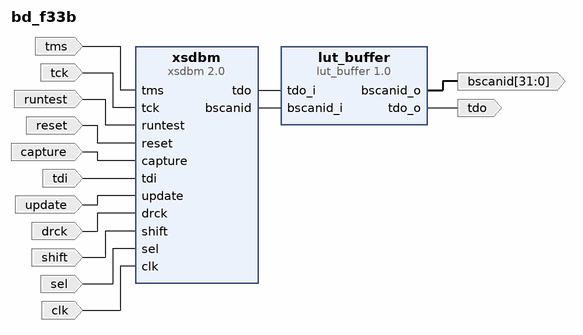
[diagram p0: block diagram of the top level]
# Vivado block design bd_f33b, xcku115-flvf1924-2-e, Vivado 2016.4
create_bd_design bd_f33b

create_bd_port -dir I -type clk clk
create_bd_port -dir I drck
create_bd_port -dir I shift
create_bd_port -dir I tdi
create_bd_port -dir I update
create_bd_port -dir I sel
create_bd_port -dir O tdo
create_bd_port -dir I tms
create_bd_port -dir I tck
create_bd_port -dir I runtest
create_bd_port -dir I reset
create_bd_port -dir I capture
create_bd_port -dir O -from 31 -to 0 bscanid

create_bd_cell -type ip -vlnv xilinx.com:ip:xsdbm:2.0 xsdbm
set_property -dict [list \
  CONFIG.C_TWO_PRIM_MODE false \
  CONFIG.C_USE_EXT_BSCAN true \
  CONFIG.C_USE_STARTUP_CLK false \
  CONFIG.C_ENABLE_CLK_DIVIDER false \
  CONFIG.C_USER_SCAN_CHAIN 1 \
  CONFIG.C_CORE_TYPE 1 \
  CONFIG.C_EN_INT_SIM 1 \
  CONFIG.C_DCLK_HAS_RESET 0 \
  CONFIG.C_USE_BUFR 0 \
  CONFIG.C_XSDB_NUM_SLAVES 0 \
  CONFIG.C_CORE_MINOR_ALPHA_VER 97 \
  CONFIG.C_CORE_MINOR_VER 0 \
  CONFIG.C_CORE_MAJOR_VER 1 \
  CONFIG.C_BUILD_REVISION 0 \
  CONFIG.C_MINOR_VERSION 1 \
  CONFIG.C_MAJOR_VERSION 14 \
  CONFIG.C_FIFO_STYLE SUBCORE \
  CONFIG.C_CLK_INPUT_FREQ_HZ 300000000 \
] [get_bd_cells xsdbm]
create_bd_cell -type ip -vlnv xilinx.com:ip:lut_buffer:1.0 lut_buffer

# ---- connections ----

connect_bd_net [get_bd_ports tms] [get_bd_pins xsdbm/tms]
connect_bd_net [get_bd_ports tck] [get_bd_pins xsdbm/tck]
connect_bd_net [get_bd_ports runtest] [get_bd_pins xsdbm/runtest]
connect_bd_net [get_bd_ports reset] [get_bd_pins xsdbm/reset]
connect_bd_net [get_bd_ports capture] [get_bd_pins xsdbm/capture]
connect_bd_net [get_bd_ports tdi] [get_bd_pins xsdbm/tdi]
connect_bd_net [get_bd_pins lut_buffer/tdo_o] [get_bd_ports tdo]
connect_bd_net [get_bd_pins xsdbm/tdo] [get_bd_pins lut_buffer/tdo_i]
connect_bd_net [get_bd_pins lut_buffer/bscanid_o] [get_bd_ports bscanid]
connect_bd_net [get_bd_pins xsdbm/bscanid] [get_bd_pins lut_buffer/bscanid_i]
connect_bd_net [get_bd_ports update] [get_bd_pins xsdbm/update]
connect_bd_net [get_bd_ports drck] [get_bd_pins xsdbm/drck]
connect_bd_net [get_bd_ports shift] [get_bd_pins xsdbm/shift]
connect_bd_net [get_bd_ports sel] [get_bd_pins xsdbm/sel]
connect_bd_net [get_bd_ports clk] [get_bd_pins xsdbm/clk]

validate_bd_design
save_bd_design
